# Altium schematic sheet RTC.SchDoc: RTC
size A4; Organization: Badgerloop; Address1: 133 Engineering Research; Address2: Building; Address3: Madison, WI 53715; SheetNumber: 12
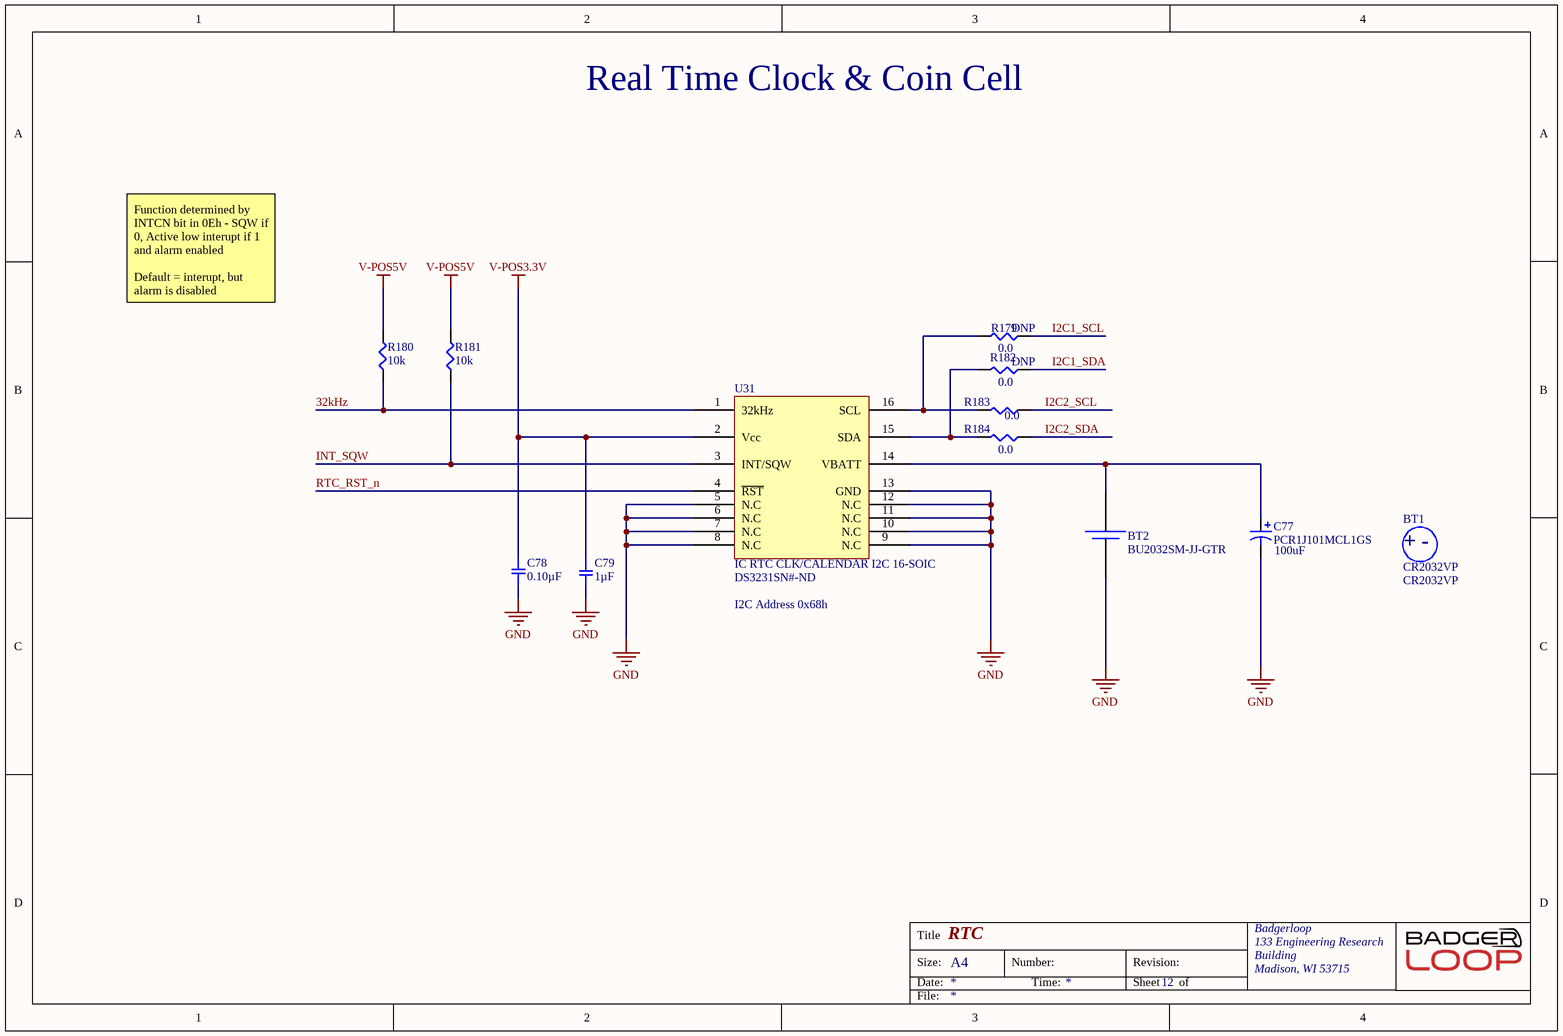
[diagram p0: RTC.SchDoc]

## Parts
BT1  CR2032VP  (mechanical)
BT2  BU2032SM-JJ-GTR  [BATTERY HOLDER COIN 20MM]
C77  PCR1J101MCL1GS  Capacitance: 100uF  [CAPAE110103X126M]
C78  0.10µF  [SMD-0805C]
C79  1µF  [SMD-0805C]
R179  0.0  [SMD-0805-RES]
R180  10k  [SMD-0805-RES]
R181  10k  [SMD-0805-RES]
R182  0.0  [SMD-0805-RES]
R183  0.0  [SMD-0805-RES]
R184  0.0  [SMD-0805-RES]
U31  IC RTC CLK/CALENDAR I2C 16-SOIC  Supplier Part Number 1: DS3231SN#-ND  [SOP127P1030X265-16N]

## Nets
GND: BT2.1(+) C77.2 C78.1 C79.2 U31.5(N.C) U31.6(N.C) U31.7(N.C) U31.8(N.C) U31.9(N.C) U31.10(N.C) U31.11(N.C) U31.12(N.C) U31.13(GND)
V-POS3.3V: C78.2 C79.1 U31.2(Vcc)
V-POS5V: R180.2 R181.2
32kHz: R180.1 U31.1(32kHz)
I2C1_SCL: R179.1
I2C1_SDA: R182.1
I2C2_SCL: R183.1
I2C2_SDA: R184.1
INT_SQW: R181.1 U31.3(INT/SQW)
RTC_RST_n: U31.4(~{RST})
NetBT2_2: BT2.2(-) C77.1 U31.14(VBATT)
NetR179_2: R179.2 R183.2 U31.16(SCL)
NetR182_2: R182.2 R184.2 U31.15(SDA)

## Notes on the sheet
- Real Time Clock & Coin Cell
- Function determined by INTCN bit in 0Eh - SQW if 0, Active low interupt if 1 and alarm enabled
  Default = interupt, but alarm is disabled
- I2C Address 0x68h
- Title
- Size:
- Date:
- A4
- Number:
- Time:
- Revision:
- Sheet
- of
- File:
- (in symbol CR2032VP) + -

## Library data of the parts
BT1 = CR2032VP: BATTERY LITHIUM 3V COIN 20MM; Manufacturer: Energizer; Capacity: 240mAh; Supplier 1: Newark; Stock 1: 0; Weight: 0.1oz; Voltage Rating: 3V; Package Quantity: 200; Height: 0.13inch; ComponentLink1URL: http://data.energizer.com/pdfs/cr2032.pdf?src-supplier=Digi-Key; ComponentLink1Description: http://data.energizer.com/pdfs/cr2032.pdf?src-supplier=Digi-Key; Supplier Part Number 1: 41P0336; Manufacturer Part Number: CR2032VP
BT2 = BU2032SM-JJ-GTR: HOLDER COIN CELL 2032 SMD; Manufacturer: Memory Protection Devices; Number of Cells: 1; Supplier 1: Digi-Key; Stock 1: 90564; Pricing 1: 1=0.99, 10=0.836, 100=0.6907 (USD); Mount: Surface Mount,PCB; Min Operating Temperature: -40°C; Max Operating Temperature: 280°C; Package Quantity: 400; Termination: SMD/SMT; ComponentLink1URL: http://www.memoryprotectiondevices.com/datasheets/BU2032SM-JJ-GTR-datasheet.pdf?src-supplier=Digi-Key; ComponentLink1Description: http://www.memoryprotectiondevices.com/datasheets/BU2032SM-JJ-GTR-datasheet.pdf?src-supplier=Digi-Key; ComponentLink2URL: https://media.digikey.com/pdf/Data%20Sheets/Memory%20Protection%20PDFs/Coin_Cell_Guide.pdf?src-supplier=Digi-Key; ComponentLink2Description: https://media.digikey.com/pdf/Data%20Sheets/Memory%20Protection%20PDFs/Coin_Cell_Guide.pdf?src-supplier=Digi-Key; Supplier Part Number 1: BU2032SM-JJ-GDKR-ND
C77 = PCR1J101MCL1GS: CAP ALUM POLY 100UF 20% 63V SMD; Manufacturer: Nichicon; ESR (Equivalent Series Resistance): 24mR; Ripple Current: 3A; Leakage Current: 3uA; Life (Hours): 4000Hour; Dissipation Factor: 0.08%; Supplier 1: Digi-Key; Manufacturer Part Number: PCR1J101MCL1GS; Stock 1: 11476; Pricing 1: 1=3.63000, 10=2.92800, 100=2.28380 (USD); RoHS: Yes; Mount: Surface Mount,PCB; Case/Package: Radial; Weight: 0.045856oz; Min Operating Temperature: -55°C; Max Operating Temperature: 125°C; Tolerance: 20%; Voltage Rating (DC): 63V; Package Quantity: 1; Packaging: Tape and Reel; Voltage Rating: 63V; Termination: SMD/SMT; Voltage: 63V; Diameter: 10mm; Length: 12.7mm; Height: 12.7mm; Height - Seated (Max): 0.504inch; Depth: 10.3mm; Lead Pitch: 4.6mm; Lead Free: Lead Free; ComponentLink1URL: https://datasheet.ciiva.com/29551/e-ch-ta-29551389.pdf?src-supplier=Digi-Key; ComponentLink1Description: https://datasheet.ciiva.com/29551/e-ch-ta-29551389.pdf?src-supplier=Digi-Key; ComponentLink2URL: https://datasheet.ciiva.com/29551/e-ch-ta-29551390.pdf?src-supplier=Digi-Key; ComponentLink2Description: https://datasheet.ciiva.com/29551/e-ch-ta-29551390.pdf?src-supplier=Digi-Key; ComponentLink3URL: https://datasheet.ciiva.com/29551/e-ch-ta-29551391.pdf?src-supplier=Digi-Key; ComponentLink3Description: https://datasheet.ciiva.com/29551/e-ch-ta-29551391.pdf?src-supplier=Digi-Key; Supplier Part Number 1: 493-13783-1-ND
C78 = GRM219R71C104JA01D: CAP CER 0.1UF 16V X7R 0805; Manufacturer: Murata Electronics North America; Factory Stock: 0; Unit Price (USD): 0.12; Minimum Quantity: 1; Tolerance: ±5%; Datasheets: -; Image: //media.digikey.com/Renders/Murata%20Renders/0805%20(2012%20Metric)%20.85mm.jpg; Digi-Key Part Number: 490-12557-1-ND; Part Number: GRM219R71C104JA01D; Quantity Available: 6635; @ qty: 0; Packaging: Cut Tape (CT); Series: GRM; Part Status: Active; Value: 0.10µF; Voltage: 16V; Temperature Coefficient: X7R; Operating Temperature: -55°C ~ 125°C; Features: -; Ratings: -; Applications: General Purpose; Mounting Type: Surface Mount, MLCC; Package / Case: 0805 (2012 Metric); Size / Dimension: 0.079" L x 0.049" W (2.00mm x 1.25mm); Height - Seated (Max): -; Thickness (Max): 0.037" (0.95mm); Lead Spacing: -; Lead Style: -
C79 = GRM21BR71H105KA12L: CAP CER 1UF 50V X7R 0805; Manufacturer: Murata Electronics North America; Factory Stock: 0; Unit Price (USD): 0.25; Minimum Quantity: 1; Tolerance: ±10%; Datasheets: http://www.murata.com/~/media/webrenewal/support/library/catalog/products/capacitor/mlcc/c02e.pdf; Image: //media.digikey.com/Renders/Murata%20Renders/0805%20(2012%20Metric)%20.85mm.jpg; Digi-Key Part Number: 490-4736-1-ND; Part Number: GRM21BR71H105KA12L; Quantity Available: 988032; @ qty: 0; Packaging: Cut Tape (CT); Series: GRM; Part Status: Active; Value: 1µF; Voltage: 50V; Temperature Coefficient: X7R; Operating Temperature: -55°C ~ 125°C; Features: -; Ratings: -; Applications: General Purpose; Mounting Type: Surface Mount, MLCC; Package / Case: 0805 (2012 Metric); Size / Dimension: 0.079" L x 0.049" W (2.00mm x 1.25mm); Height - Seated (Max): -; Thickness (Max): 0.053" (1.35mm); Lead Spacing: -; Lead Style: -
R179 R182-R184 = ERJ-6GEY0R00V: RES SMD 0.0 OHM JUMPER 1/8W 0805; Manufacturer: Panasonic Electronic Components; Factory Stock: 0; Unit Price (USD): 0.00544; @ qty: 1500; Minimum Quantity: 1; Power (Watts): 0.125W, 1/8W; Part Number: ERJ-6GEY0R00V; Datasheets: http://industrial.panasonic.com/www-cgi/jvcr13pz.cgi?E+PZ+3+AOA0001+ERJ6GEY0R00V+7+WW; Image: //media.digikey.com/Renders/Panasonic%20Renders/ERJ-0805%20Pkg.jpg; Digi-Key Part Number: P0.0ACT-ND; Quantity Available: 1597627; Packaging: Cut Tape (CT); Series: ERJ; Part Status: Active; Value: 0.0; Tolerance: Jumper; Composition: Thick Film; Features: Automotive AEC-Q200; Temperature Coefficient: -; Operating Temperature: -55°C ~ 155°C; Package / Case: 0805 (2012 Metric); Supplier Device Package: 0805; Size / Dimension: 0.079" L x 0.049" W (2.00mm x 1.25mm); Height - Seated (Max): 0.028" (0.70mm); Number of Terminations: 2; Failure Rate: -
  R179 R182: DNP: DNP
R180 R181 = ERJ-P06J103V: RES SMD 10K OHM 5% 1/2W 0805; Manufacturer: Panasonic Electronic Components; Factory Stock: 0; Unit Price (USD): 0.01839; @ qty: 1500; Minimum Quantity: 1; Power (Watts): 0.5W, 1/2W; Temperature Coefficient: ±200ppm/°C; Part Number: ERJ-P06J103V; Datasheets: https://industrial.panasonic.com/cdbs/www-data/pdf/RDA0000/AOA0000C243.pdf; Image: //media.digikey.com/Renders/Panasonic%20Renders/ERJ-0805%20Pkg.jpg; Digi-Key Part Number: P10KADCT-ND; Quantity Available: 413576; Packaging: Cut Tape (CT); Series: ERJ; Part Status: Active; Value: 10k; Tolerance: ±5%; Composition: Thick Film; Features: Automotive AEC-Q200, Pulse Withstanding; Operating Temperature: -55°C ~ 155°C; Package / Case: 0805 (2012 Metric); Supplier Device Package: 0805; Size / Dimension: 0.079" L x 0.049" W (2.00mm x 1.25mm); Height - Seated (Max): 0.028" (0.70mm); Number of Terminations: 2; Failure Rate: -
U31 = DS3231: Manufacturer: Maxim; Manufacturer Part Number: DS3231SN#; Max Supply Voltage: 5.5V; Min Supply Voltage: 2.3V; Logic Function: Clock; Time Format: HH:MM:SS; Date Format: YY-MM-DD-dd; Operating Supply Voltage: 3.3V; Interface: I2C,Serial,2-Wire; Number of Outputs: 1; Frequency: 32.768kHz; Supplier 1: Digi-Key; Stock 1: 2824; Pricing 1: 1=9.61, 10=8.685, 25=8.2812, 100=7.1906, 250=6.8674, 500=6.26146, 1000=5.45353 (USD); Mount: Surface Mount; Case/Package: SOIC; Number of Pins: 16; Weight: 0.023492oz; Min Operating Temperature: -40°C; Max Operating Temperature: 85°C; Package Quantity: 46; Packaging: Bulk; Termination: SMD/SMT; Length: 10.5mm; Height: 2.35mm; Width: 7.6mm; Radiation Hardening: No; REACH SVHC: Unknown; Lead Free: Lead Free; ComponentLink1URL: https://datasheets.maximintegrated.com/en/ds/DS3231-DS3231S.pdf?src-supplier=Digi-Key; ComponentLink1Description: https://datasheets.maximintegrated.com/en/ds/DS3231-DS3231S.pdf?src-supplier=Digi-Key; ComponentLink2URL: http://datasheets.maxim-ic.com/en/ds/DS3231.pdf?src-supplier=Avnet+Europe; ComponentLink2Description: http://datasheets.maxim-ic.com/en/ds/DS3231.pdf?src-supplier=Avnet+Europe; ComponentLink3URL: http://www.farnell.com/datasheets/1675711.pdf?src-supplier=Element14; ComponentLink3Description: http://www.farnell.com/datasheets/1675711.pdf?src-supplier=Element14; ComponentLink4URL: http://www.mouser.com/ds/2/256/DS3231-102175.pdf?src-supplier=Mouser; ComponentLink4Description: http://www.mouser.com/ds/2/256/DS3231-102175.pdf?src-supplier=Mouser; ComponentLink5URL: http://datasheets.maximintegrated.com/en/ds/DS3231.pdf?src-supplier=Avnet; ComponentLink5Description: http://datasheets.maximintegrated.com/en/ds/DS3231.pdf?src-supplier=Avnet; ComponentLink6URL: http://datasheet.iiic.cc/maxim/DS3231SN_.pdf?src-supplier=IIIC; ComponentLink6Description: http://datasheet.iiic.cc/maxim/DS3231SN_.pdf?src-supplier=IIIC